# EAGLE schematic SensorNodeBoard_4_2_1AZ1b (EAGLE 7.6.0)

## Sheet 1 of 6
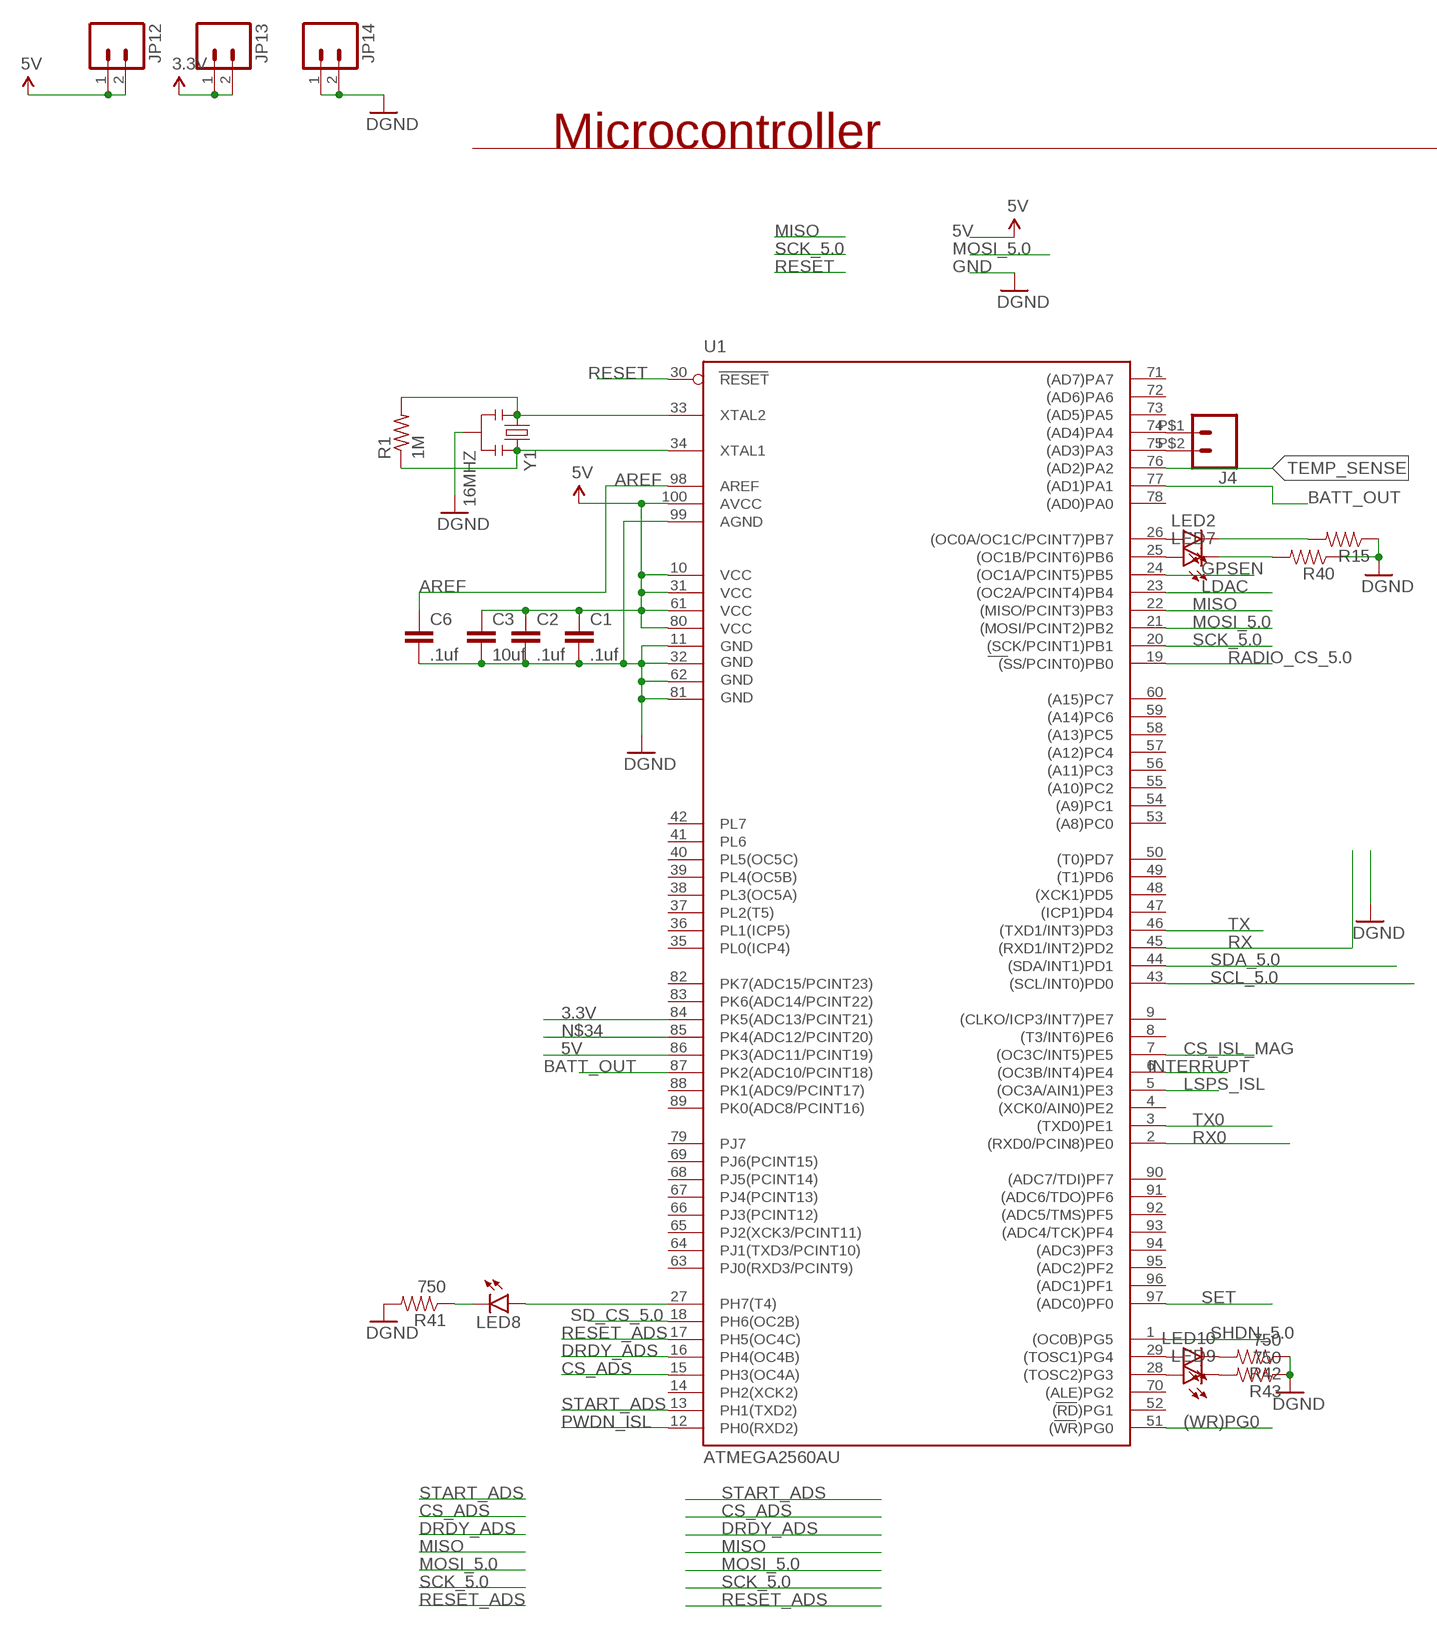
[diagram p0: schematic, sheet 1, part 1 of 2]
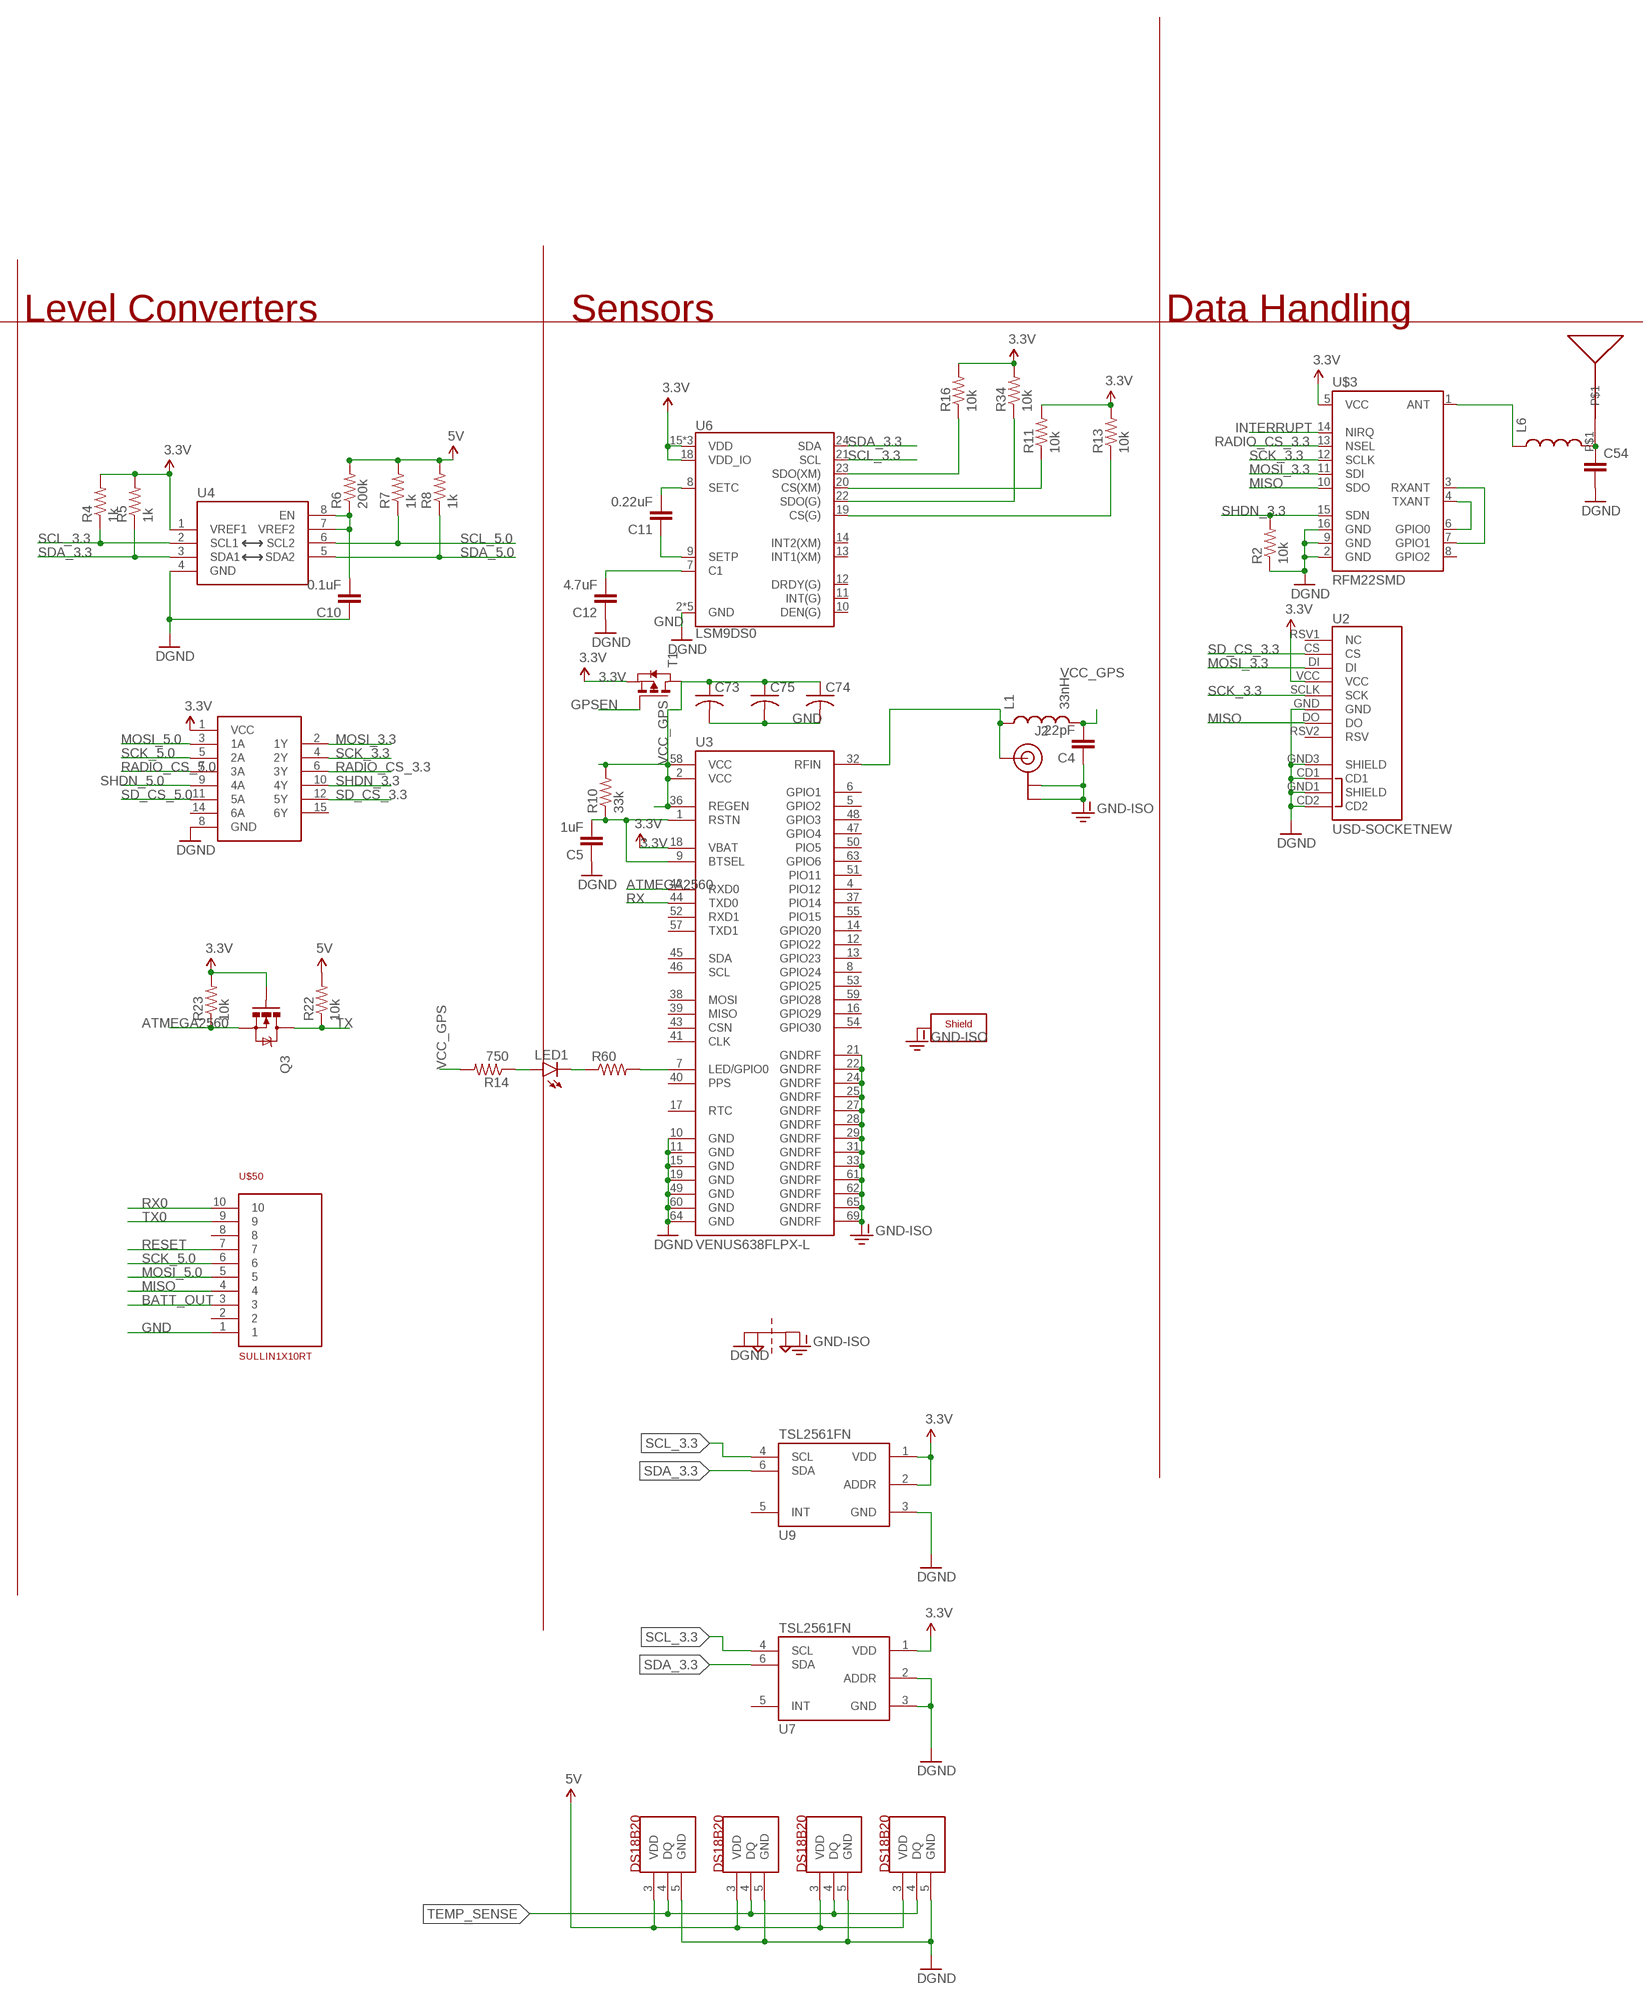
[diagram p1: schematic, sheet 1, part 2 of 2]

### Parts
C1  .1uf  CAP0603-CAP  [0603-CAP]
C2  .1uf  CAP0603-CAP  [0603-CAP]
C3  10uf  CAP0603-CAP  [0603-CAP]
C4  22pF  CAP0603-CAP  [0603-CAP]
C5  1uF  CAP0603-CAP  [0603-CAP]
C6  .1uf  CAP0603-CAP  [0603-CAP]
C10  0.1uF  CAP0603-CAP  [0603-CAP]
C11  0.22uF  CAP0603-CAP  [0603-CAP]
C12  4.7uF  CAP0603-CAP  [0603-CAP]
C54  CAP0603-CAP  [0603-CAP]
C73  C-USC0603K  [C0603K]
C74  C-USC0603K  [C0603K]
C75  C-USC0603K  [C0603K]
J2  U.FL  [U.FL]
J4  CONN_02HIROSE  [1X02_1.25]
JP12  M02LOCK  [1X02_LOCK]
JP13  M02LOCK  [1X02_LOCK]
JP14  M02LOCK  [1X02_LOCK]
L1  33nH  INDUCTOR0805  [0805]
L6  INDUCTOR0805  [0805]
LED1  LED0603  [LED-0603]
LED2  LED0603  [LED-0603]
LED7  LED0603  [LED-0603]
LED8  LED0603  [LED-0603]
LED9  LED0603  [LED-0603]
LED10  LED0603  [LED-0603]
PT1  2PT_GND_TIE  [2PT_GND_TIE]
Q3  MOSFET-NCHANNEL2N7002PW  [SOT323]
R1  1M  R-US_R1206  [R1206]
R2  10k  RESISTOR0603-RES  [0603-RES]
R4  1k  RESISTOR0603-RES  [0603-RES]
R5  1k  RESISTOR0603-RES  [0603-RES]
R6  200k  RESISTOR0603-RES  [0603-RES]
R7  1k  RESISTOR0603-RES  [0603-RES]
R8  1k  RESISTOR0603-RES  [0603-RES]
R10  33k  RESISTOR0603-RES  [0603-RES]
R11  10k  RESISTOR0603-RES  [0603-RES]
R13  10k  RESISTOR0603-RES  [0603-RES]
R14  750  RESISTOR0603-RES  [0603-RES]
R15  RESISTOR0603-RES  [0603-RES]
R16  10k  RESISTOR0603-RES  [0603-RES]
R22  10k  RESISTOR0603-RES  [0603-RES]
R23  10k  RESISTOR0603-RES  [0603-RES]
R34  10k  RESISTOR0603-RES  [0603-RES]
R40  RESISTOR0603-RES  [0603-RES]
R41  750  RESISTOR0603-RES  [0603-RES]
R42  750  RESISTOR0603-RES  [0603-RES]
R43  750  RESISTOR0603-RES  [0603-RES]
R60  R-US_R0603  [R0603]
T1  PMOSSOT23-6  [SOT23-6]
U1  ATMEGA2560AU  [TQFP100]
U2  USD-SOCKETNEW  [MICRO-SD-SOCKET-PP]
U3  VENUS638FLPX-L  [VENUS638FLPX]
U4  PCA9306  [PSOP-8]
U6  LSM9DS0  [LGA-24]
U7  TSL2561FN  [FN-6]
U9  TSL2561FN  [FN-6]
U$1  74HC4050  [TSSOP16]
U$3  RFM22SMD  [RFM22-XXX-S2]
U$23  SNB_ANT  [SLOT]
U$24  DS18B202  [SO08]
U$25  DS18B202  [SO08]
U$47  DS18B202  [SO08]
U$48  DS18B202  [SO08]
U$50  SULLIN1X10RT  [SULLRT1X10-2MM]
U$52  SHEILD3  [SHIELD_BMI-201-C-REV]
Y1  16MHZ  RESONATOR16MHZ  [RESONATOR-SMD]

### Nets
3.3V: JP13.1 JP13.2 Q3.1(G) R4.2 R5.2 R11.2 R13.2 R16.2 R23.2 R34.2 T1.4(S) U1.84(PK5(ADC13/PCINT21)) U2.VCC U3.18(VBAT) U4.1(VREF1) U6.15(VDD) U6.16(VDD) U6.17(VDD) U6.18(VDD_IO) U7.1(VDD) U9.1(VDD) U9.2(ADDR) U$1.1(VCC) U$3.5(VCC) ; also sheet 6
5V: C1.1 C2.1 C3.1 JP12.1 JP12.2 R6.2 R7.2 R8.2 R22.2 U1.10(VCC) U1.31(VCC1) U1.61(VCC2) U1.80(VCC3) U1.86(PK3(ADC11/PCINT19)) U1.100(AVCC) U$24.3(VDD) U$25.3(VDD) U$47.3(VDD) U$48.3(VDD) ; also sheet 5
(WR)PG0: U1.51((WR)PG0)
AREF: C6.1 U1.98(AREF)
ATMEGA2560: Q3.2(S) R23.1 U3.42(RXD0)
BATT_OUT: U1.77((AD1)PA1) U1.87(PK2(ADC10/PCINT18)) U$50.3 ; also sheet 3,4,5,6
CS_ADS: U1.15(PH3(OC4A)) ; also sheet 2
CS_ISL_MAG: U1.7((OC3C/INT5)PE5)
DRDY_ADS: U1.16(PH4(OC4B)) ; also sheet 2
GND: C1.2 C2.2 C3.2 C5.1 C6.2 C10.1 C12.1 C54.2 C73.2 C74.2 C75.2 JP14.1 JP14.2 PT1.P$1 R2.1 R15.1 R40.1 R41.2 R42.1 R43.1 U1.11(GND) U1.32(GND1) U1.62(GND2) U1.81(GND3) U1.99(AGND) U2.CD1 U2.CD2 U2.GND U2.GND1(SHIELD) U2.GND3(SHIELD) U3.10(GND) U3.11(GND) U3.15(GND) U3.19(GND) U3.49(GND) U3.60(GND) U3.64(GND) U4.4(GND) U6.2(GND) U6.3(GND) U6.4(GND) U6.5(GND) U6.6(GND) U7.2(ADDR) U7.3(GND) U9.3(GND) U$1.8(GND) U$3.2(GND) U$3.9(GND) U$3.16(GND) U$24.5(GND) U$25.5(GND) U$47.5(GND) U$48.5(GND) U$50.1 Y1.2 ; supply symbol labelled DGND ; also sheet 2,3,4,5,6
GND-ISO: C4.1 J2.P$1(GND) J2.P$2(GND) PT1.P$2 U3.21(GNDRF) U3.22(GNDRF) U3.24(GNDRF) U3.25(GNDRF) U3.27(GNDRF) U3.28(GNDRF) U3.29(GNDRF) U3.31(GNDRF) U3.33(GNDRF) U3.61(GNDRF) U3.62(GNDRF) U3.65(GNDRF) U3.69(GNDRF) U$52.P$1 U$52.P$2 U$52.P$3 U$52.P$4 U$52.P$5 U$52.P$6 U$52.P$7 U$52.P$8 U$52.P$9
GPSEN: T1.3(G) U1.24((OC1A/PCINT5)PB5)
INTERRUPT: U1.6((OC3B/INT4)PE4) U$3.14(NIRQ)
LDAC: U1.23((OC2A/PCINT4)PB4)
LSPS_ISL: U1.5((OC3A/AIN1)PE3)
MISO: U1.22((MISO/PCINT3)PB3) U2.DO U$3.10(SDO) U$50.4 ; also sheet 2
MOSI_3.3: U2.DI U$1.2(1Y) U$3.11(SDI)
MOSI_5.0: U1.21((MOSI/PCINT2)PB2) U$1.3(1A) U$50.5 ; also sheet 2
N$1: C11.1 U6.9(SETP)
N$2: J2.P$3(SIGNAL) L1.1 U3.32(RFIN)
N$3: R1.1 U1.34(XTAL1) Y1.3
N$4: R1.2 U1.33(XTAL2) Y1.1
N$7: C10.2 R6.1 U4.7(VREF2) U4.8(EN)
N$8: U$3.4(TXANT) U$3.6(GPIO0)
N$9: U$3.3(RXANT) U$3.7(GPIO1)
N$10: C11.2 U6.8(SETC)
N$11: C12.2 U6.7(C1)
N$13: LED2.A U1.26((OC0A/OC1C/PCINT7)PB7)
N$14: R11.1 U6.20(CS(XM))
N$15: R13.1 U6.19(CS(G))
N$16: J4.P$1 U1.74((AD4)PA4)
N$17: J4.P$2 U1.75((AD3)PA3)
N$18: C5.2 R10.1 U3.1(RSTN) U3.9(BTSEL)
N$19: LED1.A R14.1
N$20: LED1.C R60.1
N$21: LED2.C R15.2
N$25: R60.2 U3.7(LED/GPIO0)
N$34: U1.85(PK4(ADC12/PCINT20)) ; also sheet 4
N$36: R16.1 U6.23(SDO(XM))
N$37: R34.1 U6.22(SDO(G))
N$64: LED7.A U1.25((OC1B/PCINT6)PB6)
N$65: LED7.C R40.2
N$66: LED8.A U1.27(PH7(T4))
N$67: LED8.C R41.1
N$68: LED9.A U1.28((TOSC2)PG3)
N$69: LED10.A U1.29((TOSC1)PG4)
N$70: LED10.C R42.2
N$71: LED9.C R43.2
N$99: C54.1 L6.2 U$23.P$1
N$102: L6.1 U$3.1(ANT)
PWDN_ISL: U1.12(PH0(RXD2))
RADIO_CS_3.3: U$1.6(3Y) U$3.13(NSEL)
RADIO_CS_5.0: U1.19((SS/PCINT0)PB0) U$1.7(3A)
RESET: U1.30(RESET) U$50.7
RESET_ADS: U1.17(PH5(OC4C)) ; also sheet 2
RX: U1.45((RXD1/INT2)PD2) U3.44(TXD0)
RX0: U1.2((RXD0/PCIN8)PE0) U$50.10
SCK_3.3: U2.SCLK(SCK) U$1.4(2Y) U$3.12(SCLK)
SCK_5.0: U1.20((SCK/PCINT1)PB1) U$1.5(2A) U$50.6 ; also sheet 2
SCL_3.3: R4.1 U4.2(SCL1) U6.21(SCL) U7.4(SCL) U9.4(SCL)
SCL_5.0: R7.1 U1.43((SCL/INT0)PD0) U4.6(SCL2)
SD_CS_3.3: U2.CS U$1.12(5Y)
SD_CS_5.0: U1.18(PH6(OC2B)) U$1.11(5A)
SDA_3.3: R5.1 U4.3(SDA1) U6.24(SDA) U7.6(SDA) U9.6(SDA)
SDA_5.0: R8.1 U1.44((SDA/INT1)PD1) U4.5(SDA2)
SET: U1.97((ADC0)PF0) ; also sheet 2
SHDN_3.3: R2.2 U$1.10(4Y) U$3.15(SDN)
SHDN_5.0: U1.1((OC0B)PG5) U$1.9(4A)
START_ADS: U1.13(PH1(TXD2)) ; also sheet 2
TEMP_SENSE: U1.76((AD2)PA2) U$24.4(DQ) U$25.4(DQ) U$47.4(DQ) U$48.4(DQ)
TX: Q3.3(D) R22.1 U1.46((TXD1/INT3)PD3)
TX0: U1.3((TXD0)PE1) U$50.9
VCC_GPS: C4.2 C73.1 C74.1 C75.1 L1.2 R10.2 R14.2 T1.1(D) T1.2(D) T1.5(D) T1.6(D) U3.2(VCC) U3.36(REGEN) U3.58(VCC)
Unconnected: U1.4((XCK0/AIN0)PE2) U1.8((T3/INT6)PE6) U1.9((CLKO/ICP3/INT7)PE7) U1.14(PH2(XCK2)) U1.35(PL0(ICP4)) U1.36(PL1(ICP5)) U1.37(PL2(T5)) U1.38(PL3(OC5A)) U1.39(PL4(OC5B)) U1.40(PL5(OC5C)) U1.41(PL6) U1.42(PL7) U1.47((ICP1)PD4) U1.48((XCK1)PD5) U1.49((T1)PD6) U1.50((T0)PD7) U1.52((RD)PG1) U1.53((A8)PC0) U1.54((A9)PC1) U1.55((A10)PC2) U1.56((A11)PC3) U1.57((A12)PC4) U1.58((A13)PC5) U1.59((A14)PC6) U1.60((A15)PC7) U1.63(PJ0(RXD3/PCINT9)) U1.64(PJ1(TXD3/PCINT10)) U1.65(PJ2(XCK3/PCINT11)) U1.66(PJ3(PCINT12)) U1.67(PJ4(PCINT13)) U1.68(PJ5(PCINT14)) U1.69(PJ6(PCINT15)) U1.70((ALE)PG2) U1.71((AD7)PA7) U1.72((AD6)PA6) U1.73((AD5)PA5) U1.78((AD0)PA0) U1.79(PJ7) U1.82(PK7(ADC15/PCINT23)) U1.83(PK6(ADC14/PCINT22)) U1.88(PK1(ADC9/PCINT17)) U1.89(PK0(ADC8/PCINT16)) U1.90((ADC7/TDI)PF7) U1.91((ADC6/TDO)PF6) U1.92((ADC5/TMS)PF5) U1.93((ADC4/TCK)PF4) U1.94((ADC3)PF3) U1.95((ADC2)PF2) U1.96((ADC1)PF1) U2.RSV1(NC) U2.RSV2(RSV) U3.4(PIO12) U3.5(GPIO2) U3.6(GPIO1) U3.8(GPIO24) U3.12(GPIO22) U3.13(GPIO23) U3.14(GPIO20) U3.16(GPIO29) U3.17(RTC) U3.37(PIO14) U3.38(MOSI) U3.39(MISO) U3.40(PPS) U3.41(CLK) U3.43(CSN) U3.45(SDA) U3.46(SCL) U3.47(GPIO4) U3.48(GPIO3) U3.50(PIO5) U3.51(PIO11) U3.52(RXD1) U3.53(GPIO25) U3.54(GPIO30) U3.55(PIO15) U3.57(TXD1) U3.59(GPIO28) U3.63(GPIO6) U6.10(DEN(G)) U6.11(INT(G)) U6.12(DRDY(G)) U6.13(INT1(XM)) U6.14(INT2(XM)) U7.5(INT) U9.5(INT) U$1.14(6A) U$1.15(6Y) U$3.8(GPIO2) U$50.2 U$50.8

### Notes on the sheet
- Microcontroller | Level Converters | Sensors | Data Handling

## Sheet 2 of 6
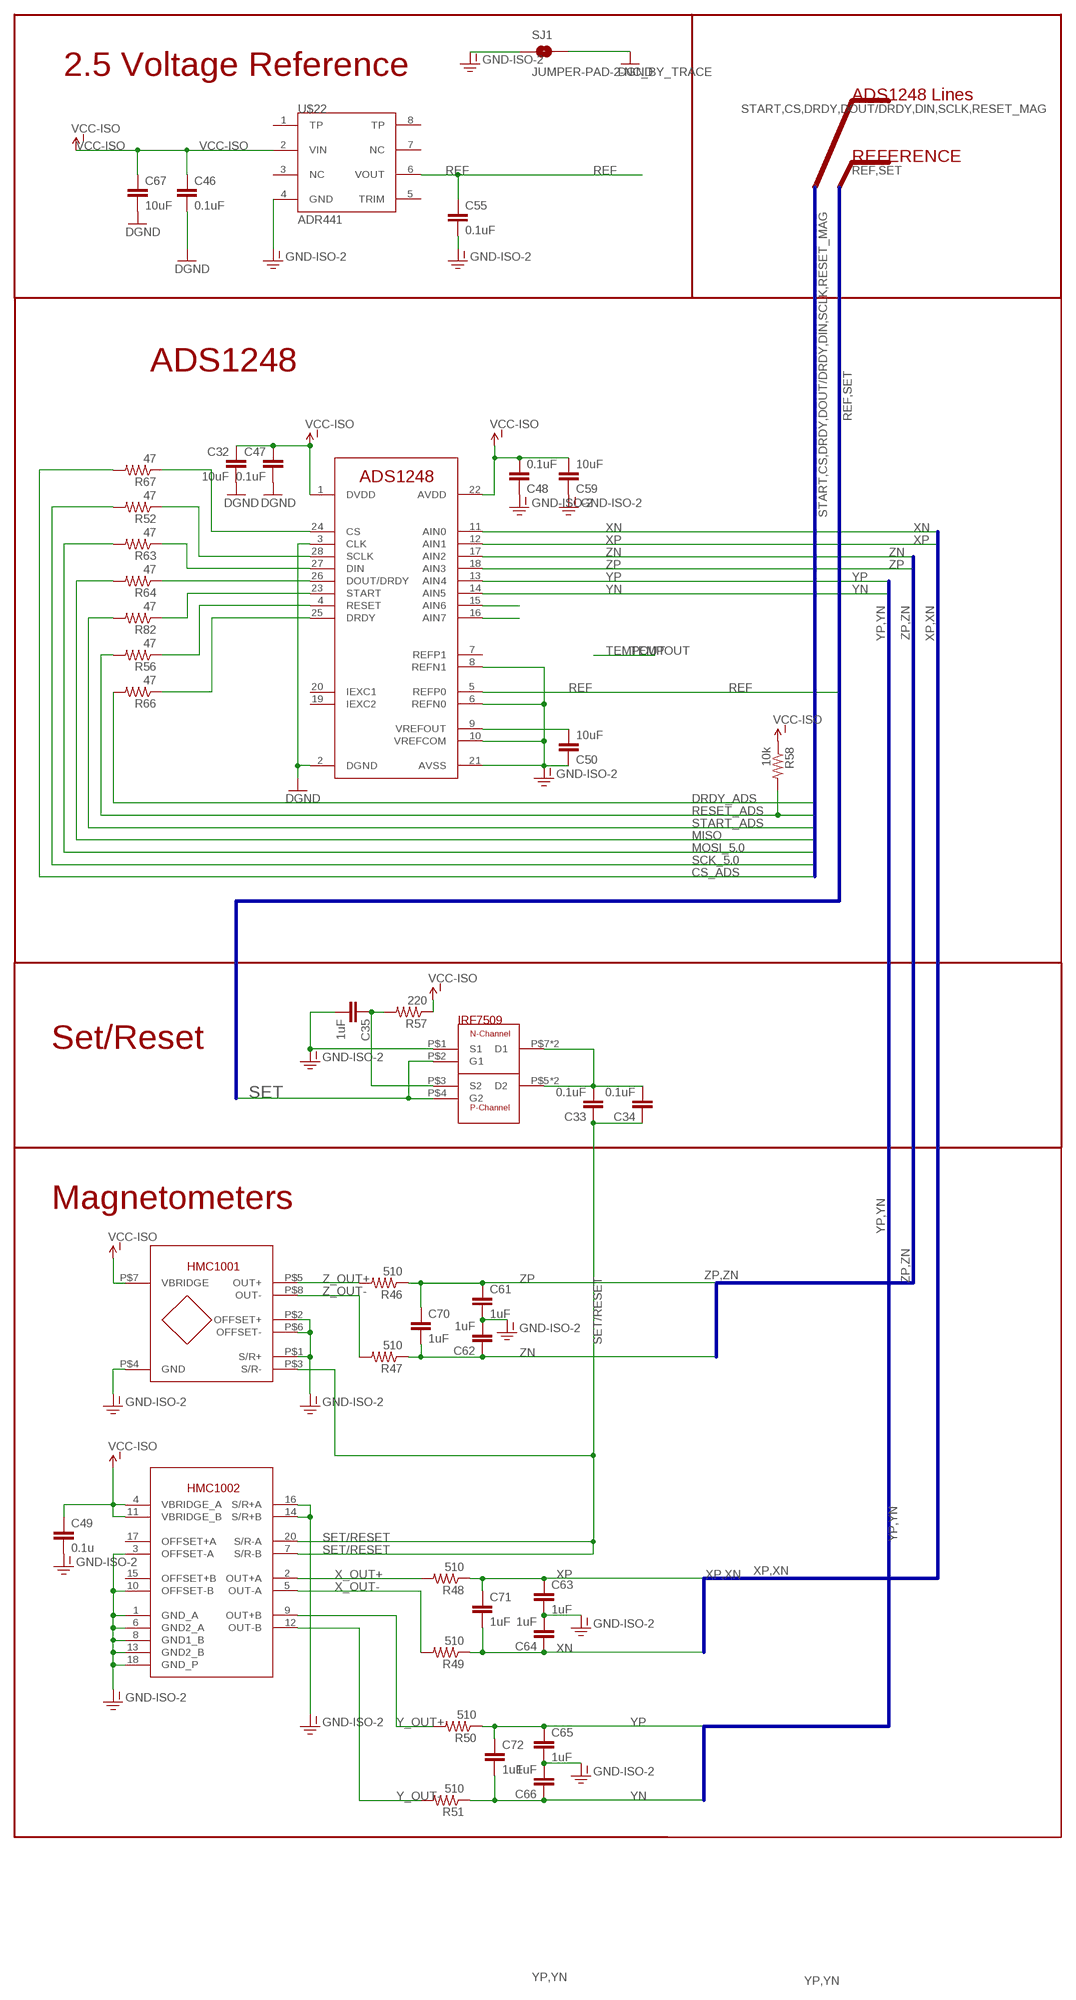
[diagram p2: schematic, sheet 2]

### Parts
C32  10uF  CAP0603-CAP  [0603-CAP]
C33  0.1uF  CAP0603-CAP  [0603-CAP]
C34  0.1uF  CAP0603-CAP  [0603-CAP]
C35  1uF  CAP0603-CAP  [0603-CAP]
C46  0.1uF  CAP0603-CAP  [0603-CAP]
C47  0.1uF  CAP0603-CAP  [0603-CAP]
C48  0.1uF  CAP0603-CAP  [0603-CAP]
C49  0.1u  CAP0603-CAP  [0603-CAP]
C50  10uF  CAP0603-CAP  [0603-CAP]
C55  0.1uF  CAP0603-CAP  [0603-CAP]
C59  10uF  CAP0603-CAP  [0603-CAP]
C61  1uF  CAP0603-CAP  [0603-CAP]
C62  1uF  CAP0603-CAP  [0603-CAP]
C63  1uF  CAP0603-CAP  [0603-CAP]
C64  1uF  CAP0603-CAP  [0603-CAP]
C65  1uF  CAP0603-CAP  [0603-CAP]
C66  1uF  CAP0603-CAP  [0603-CAP]
C67  10uF  CAP0603-CAP  [0603-CAP]
C70  1uF  CAP0603-CAP  [0603-CAP]
C71  1uF  CAP0603-CAP  [0603-CAP]
C72  1uF  CAP0603-CAP  [0603-CAP]
R46  510  RESISTOR0603-RES  [0603-RES]
R47  510  RESISTOR0603-RES  [0603-RES]
R48  510  RESISTOR0603-RES  [0603-RES]
R49  510  RESISTOR0603-RES  [0603-RES]
R50  510  RESISTOR0603-RES  [0603-RES]
R51  510  RESISTOR0603-RES  [0603-RES]
R52  47  RESISTOR0603-RES  [0603-RES]
R56  47  RESISTOR0603-RES  [0603-RES]
R57  220  RESISTOR0603-RES  [0603-RES]
R58  10k  RESISTOR0603-RES  [0603-RES]
R63  47  RESISTOR0603-RES  [0603-RES]
R64  47  RESISTOR0603-RES  [0603-RES]
R66  47  RESISTOR0603-RES  [0603-RES]
R67  47  RESISTOR0603-RES  [0603-RES]
R82  47  RESISTOR0603-RES  [0603-RES]
SJ1  JUMPER-PAD-2-NC_BY_TRACE  [PAD-JUMPER-2-NC_BY_TRACE_YES_SILK]
U$7  ADS1248  [TSSOP28]
U$11  HMC1002  [SOIC20R]
U$12  HMC1001  [HMC1001]
U$17  IRF7509  [MICRO8]
U$22  ADR441  [SOIC8]

### Nets
ADS4: R56.1 U$7.4(RESET)
ADS9: C50.2 U$7.9(VREFOUT)
ADS15: U$7.15(AIN6)
ADS16: U$7.16(AIN7)
ADS23: R82.1 U$7.23(START)
ADS24: R67.1 U$7.24(CS)
ADS25: R66.1 U$7.25(DRDY)
ADS26: R64.1 U$7.26(DOUT/DRDY)
ADS27: R63.1 U$7.27(DIN)
ADS28: R52.1 U$7.28(SCLK)
CS_ADS: R67.2 ; also sheet 1
DRDY_ADS: R66.2 ; also sheet 1
GND: C32.2 C46.2 C47.2 C67.2 SJ1.2 U$7.2(DGND) U$7.3(CLK) ; supply symbol labelled DGND ; also sheet 1,3,4,5,6
GND-ISO-2: C35.2 C48.1 C49.2 C50.1 C55.2 C59.1 C61.2 C62.2 C63.2 C64.2 C65.2 C66.2 SJ1.1 U$7.6(REFN0) U$7.8(REFN1) U$7.10(VREFCOM) U$7.21(AVSS) U$11.1(GND_A) U$11.3(OFFSET-A) U$11.6(GND2_A) U$11.8(GND1_B) U$11.10(OFFSET-B) U$11.13(GND2_B) U$11.14(S/R+B) U$11.16(S/R+A) U$11.18(GND_P) U$12.P$1(S/R+) U$12.P$2(OFFSET+) U$12.P$4(GND) U$12.P$6(OFFSET-) U$17.P$1(S1) U$22.4(GND)
MISO: R64.2 ; also sheet 1
MOSI_5.0: R63.2 ; also sheet 1
N$78: C33.2 C34.2 U$17.P$5(D2) U$17.P$6(D2) U$17.P$7(D1) U$17.P$8(D1)
N$79: C35.1 R57.2 U$17.P$3(S2)
REF: C55.1 U$7.5(REFP0) U$22.6(VOUT)
RESET_ADS: R56.2 R58.2 ; also sheet 1
SCK_5.0: R52.2 ; also sheet 1
SET: U$17.P$2(G1) U$17.P$4(G2) ; also sheet 1
SET/RESET: C33.1 C34.1 U$11.7(S/R-B) U$11.20(S/R-A) U$12.P$3(S/R-)
START_ADS: R82.2 ; also sheet 1
VCC-ISO: C32.1 C46.1 C47.1 C48.2 C49.1 C59.2 C67.1 R57.1 R58.1 U$7.1(DVDD) U$7.22(AVDD) U$11.4(VBRIDGE_A) U$11.11(VBRIDGE_B) U$12.P$7(VBRIDGE) U$22.2(VIN) ; also sheet 4
X_OUT+: R48.2 U$11.2(OUT+A)
X_OUT-: R49.2 U$11.5(OUT-A)
XN: C64.1 C71.2 R49.1 U$7.11(AIN0)
XP: C63.1 C71.1 R48.1 U$7.12(AIN1)
Y_OUT+: R50.2 U$11.9(OUT+B)
Y_OUT-: R51.2 U$11.12(OUT-B)
YN: C66.1 C72.2 R51.1 U$7.14(AIN5)
YP: C65.1 C72.1 R50.1 U$7.13(AIN4)
Z_OUT+: R46.2 U$12.P$5(OUT+)
Z_OUT-: R47.2 U$12.P$8(OUT-)
ZN: C62.1 C70.2 R47.1 U$7.17(AIN2)
ZP: C61.1 C70.1 R46.1 U$7.18(AIN3)
Unconnected: U$7.7(REFP1) U$7.19(IEXC2) U$7.20(IEXC1) U$11.15(OFFSET+B) U$11.17(OFFSET+A) U$22.1(TP) U$22.3(NC) U$22.5(TRIM) U$22.7(NC) U$22.8(TP)

### Buses
XP,XN
YP,YN
ZP,ZN
START,CS,DRDY,DOUT/DRDY,DIN,SCLK,RESET_MAG
REF,SET

### Notes on the sheet
- 2.5 Voltage Reference
- ADS1248 Lines
- REFERENCE
- ADS1248
- Set/Reset
- Magnetometers

## Sheet 3 of 6
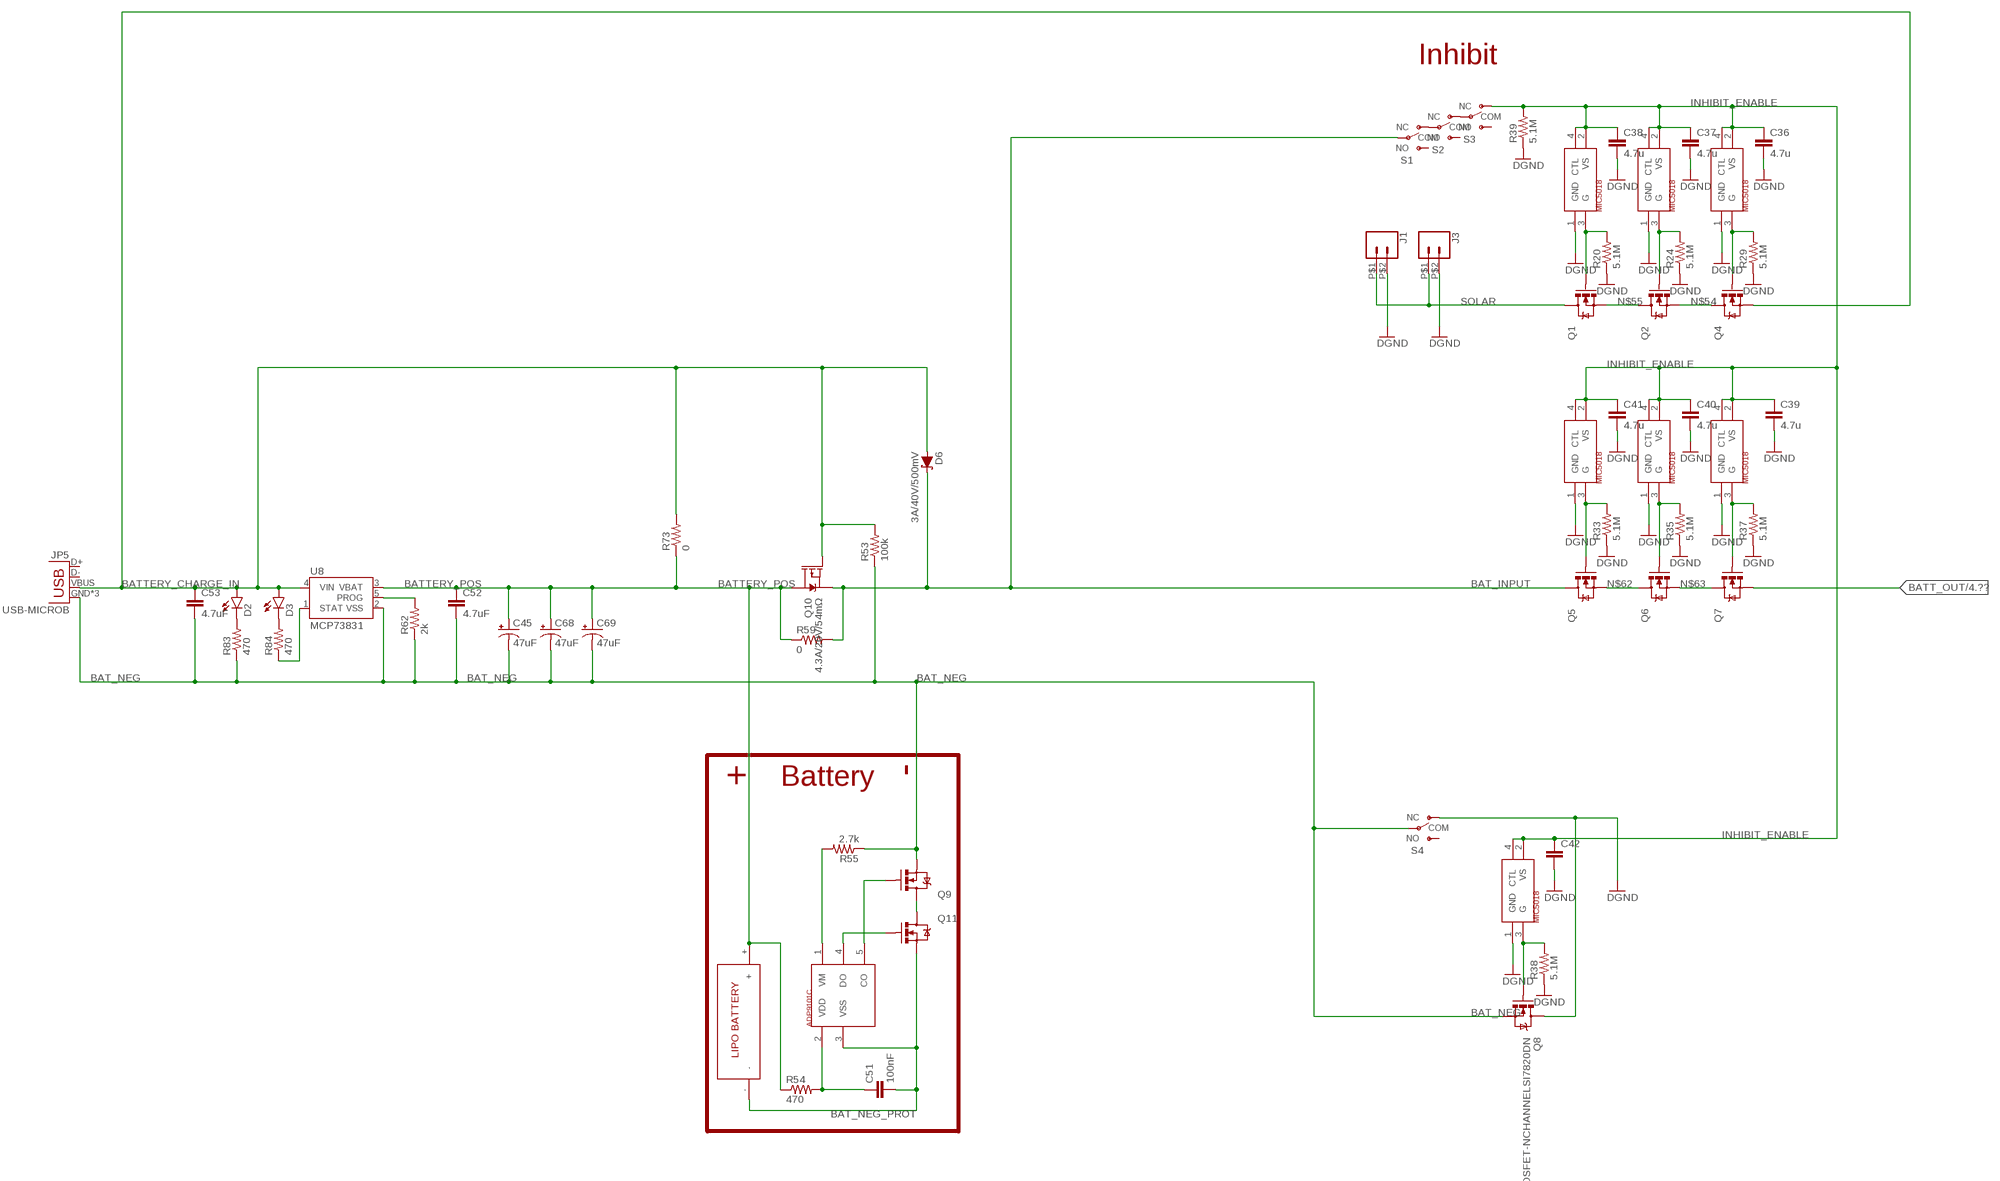
[diagram p3: schematic, sheet 3]

### Parts
C36  4.7u  CAP0603-CAP  [0603-CAP]
C37  4.7u  CAP0603-CAP  [0603-CAP]
C38  4.7u  CAP0603-CAP  [0603-CAP]
C39  4.7u  CAP0603-CAP  [0603-CAP]
C40  4.7u  CAP0603-CAP  [0603-CAP]
C41  4.7u  CAP0603-CAP  [0603-CAP]
C42  CAP0603-CAP  [0603-CAP]
C45  47uF  CAP_POL1206  [EIA3216]
C51  100nF  CAP0603-CAP  [0603-CAP]
C52  4.7uF  CAP0603-CAP  [0603-CAP]
C53  4.7uF  CAP0603-CAP  [0603-CAP]
C68  47uF  CAP_POL1206  [EIA3216]
C69  47uF  CAP_POL1206  [EIA3216]
D2  LED0603  [LED-0603]
D3  LED0603  [LED-0603]
D6  3A/40V/500mV  DIODE-SCHOTTKY-B340A  [SMA-DIODE]
J1  CONN_02HIROSE  [1X02_1.25]
J3  CONN_02HIROSE  [1X02_1.25]
JP5  USB-MICROB  [USB-MICROB]
Q1  MOSFET-NCHANNELSI7820DN  [POWERPAK1212-8]
Q2  MOSFET-NCHANNELSI7820DN  [POWERPAK1212-8]
Q4  MOSFET-NCHANNELSI7820DN  [POWERPAK1212-8]
Q5  MOSFET-NCHANNELSI7820DN  [POWERPAK1212-8]
Q6  MOSFET-NCHANNELSI7820DN  [POWERPAK1212-8]
Q7  MOSFET-NCHANNELSI7820DN  [POWERPAK1212-8]
Q8  MOSFET-NCHANNELSI7820DN  [POWERPAK1212-8]
Q9  MOSFET-NCHANNELSSM3K324R  [SOT23-3@1]
Q10  4.3A/20V/54mΩ  MOSFET_PCH-IRLML2244  [SOT23-3]
Q11  MOSFET-NCHANNELSSM3K324R  [SOT23-3@1]
R20  5.1M  RESISTOR0603-RES  [0603-RES]
R24  5.1M  RESISTOR0603-RES  [0603-RES]
R29  5.1M  RESISTOR0603-RES  [0603-RES]
R33  5.1M  RESISTOR0603-RES  [0603-RES]
R35  5.1M  RESISTOR0603-RES  [0603-RES]
R37  5.1M  RESISTOR0603-RES  [0603-RES]
R38  5.1M  RESISTOR0603-RES  [0603-RES]
R39  5.1M  RESISTOR0603-RES  [0603-RES]
R53  100k  RESISTOR0603-RES  [0603-RES]
R54  470  RESISTOR0603-RES  [0603-RES]
R55  2.7k  RESISTOR0603-RES  [0603-RES]
R59  0  RESISTOR2010  [R2010]
R62  2k  R-US_R0603  [R0603]
R73  0  RESISTOR2010  [R2010]
R83  470  RESISTOR0603-RES  [0603-RES]
R84  470  RESISTOR0603-RES  [0603-RES]
S1  SWITCH-SPDT  [CHERRY_SWITCH]
S2  SWITCH-SPDT  [CHERRY_SWITCH]
S3  SWITCH-SPDT  [CHERRY_SWITCH]
S4  SWITCH-SPDT  [CHERRY_SWITCH]
U8  MCP73831  [SOT23-5]
U$8  MIC5018  [SOT143]
U$13  MIC5018  [SOT143]
U$14  MIC5018  [SOT143]
U$15  MIC5018  [SOT143]
U$16  MIC5018  [SOT143]
U$18  BATTERY  [BATTERY]
U$19  MIC5018  [SOT143]
U$20  MIC5018  [SOT143]
U$27  AP9101C  [SOT25]

### Nets
BAT_INPUT: D6.C Q5.D1(D) Q5.D2(D) Q5.D3(D) Q5.D4(D) Q5.DPAD(D) Q10.2(S) R59.2 S1.COM
BAT_NEG: C45.C(-) C52.2 C53.2 C68.C(-) C69.C(-) JP5.GND JP5.MT1(GND) JP5.MT2(GND) Q8.S1(S) Q8.S2(S) Q8.S3(S) Q9.2(S) R53.1 R55.1 R62.1 R83.1 S4.COM U8.2(VSS)
BAT_NEG_PROT: C51.2 Q11.2(S) U$18.- U$27.3(VSS)
BATT_OUT: Q7.S1(S) Q7.S2(S) Q7.S3(S) ; also sheet 1,4,5,6
BATTERY_CHARGE_IN: C53.1 D2.A D3.A D6.A JP5.VBUS Q4.S1(S) Q4.S2(S) Q4.S3(S) Q10.1(G) R53.2 R73.2 U8.4(VIN)
BATTERY_POS: C45.A(+) C52.1 C68.A(+) C69.A(+) Q10.3(D) R54.1 R59.1 R73.1 U8.3(VBAT) U$18.+
GND: C36.2 C37.2 C38.2 C39.2 C40.2 C41.2 C42.2 J1.P$2 J3.P$2 Q8.D1(D) Q8.D2(D) Q8.D3(D) Q8.D4(D) Q8.DPAD(D) R20.1 R24.1 R29.1 R33.1 R35.1 R37.1 R38.1 R39.1 S4.NC U$8.1(GND) U$13.1(GND) U$14.1(GND) U$15.1(GND) U$16.1(GND) U$19.1(GND) U$20.1(GND) ; supply symbol labelled DGND ; also sheet 1,2,4,5,6
INHIBIT_ENABLE: C36.1 C37.1 C38.1 C39.1 C40.1 C41.1 C42.1 R39.2 S3.NC U$8.2(VS) U$8.4(CTL) U$13.2(VS) U$13.4(CTL) U$14.2(VS) U$14.4(CTL) U$15.2(VS) U$15.4(CTL) U$16.2(VS) U$16.4(CTL) U$19.2(VS) U$19.4(CTL) U$20.2(VS) U$20.4(CTL)
N$49: S1.NC S2.COM
N$50: S2.NC S3.COM
N$51: Q1.G R20.2 U$8.3(G)
N$52: Q2.G R24.2 U$13.3(G)
N$53: Q4.G R29.2 U$14.3(G)
N$54: Q2.S1(S) Q2.S2(S) Q2.S3(S) Q4.D1(D) Q4.D2(D) Q4.D3(D) Q4.D4(D) Q4.DPAD(D)
N$55: Q1.S1(S) Q1.S2(S) Q1.S3(S) Q2.D1(D) Q2.D2(D) Q2.D3(D) Q2.D4(D) Q2.DPAD(D)
N$56: D2.C R83.2
N$57: Q11.1(G) U$27.4(DO)
N$59: Q5.G R33.2 U$15.3(G)
N$60: Q6.G R35.2 U$16.3(G)
N$61: Q7.G R37.2 U$19.3(G)
N$62: Q5.S1(S) Q5.S2(S) Q5.S3(S) Q6.D1(D) Q6.D2(D) Q6.D3(D) Q6.D4(D) Q6.DPAD(D)
N$63: Q6.S1(S) Q6.S2(S) Q6.S3(S) Q7.D1(D) Q7.D2(D) Q7.D3(D) Q7.D4(D) Q7.DPAD(D)
N$75: Q8.G R38.2 U$20.3(G)
N$96: Q9.1(G) U$27.5(CO)
N$97: Q9.3(D) Q11.3(D)
N$98: R62.2 U8.5(PROG)
N$100: R55.2 U$27.1(VM)
N$101: C51.1 R54.2 U$27.2(VDD)
N$104: D3.C R84.2
N$105: R84.1 U8.1(STAT)
SOLAR: J1.P$1 J3.P$1 Q1.D1(D) Q1.D2(D) Q1.D3(D) Q1.D4(D) Q1.DPAD(D)
Unconnected: JP5.D+ JP5.D- S1.NO S2.NO S3.NO S4.NO

### Notes on the sheet
- Inhibit
- + | -
- Battery

## Sheet 4 of 6
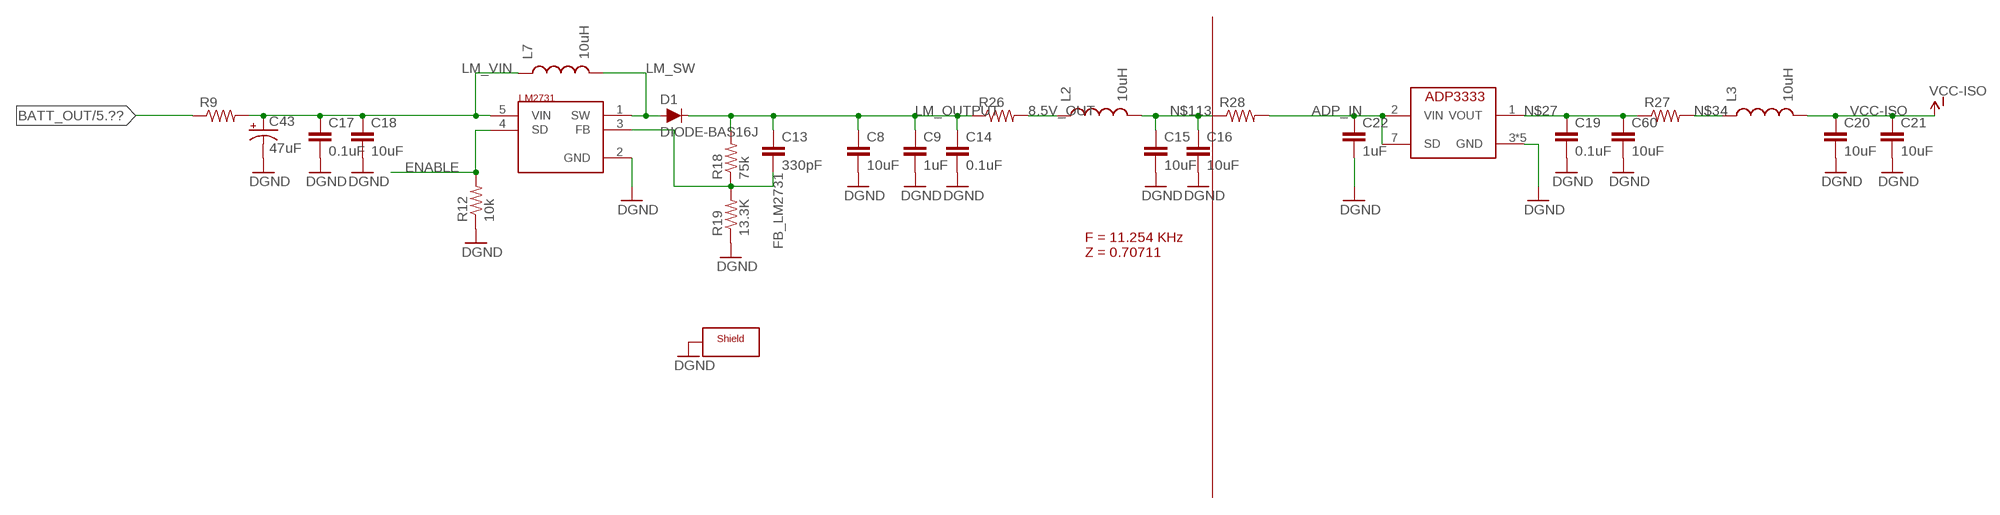
[diagram p4: schematic, sheet 4]

### Parts
C8  10uF  CAP0603-CAP  [0603-CAP]
C9  1uF  CAP0603-CAP  [0603-CAP]
C13  330pF  CAP0603-CAP  [0603-CAP]
C14  0.1uF  CAP0603-CAP  [0603-CAP]
C15  10uF  CAP0603-CAP  [0603-CAP]
C16  10uF  CAP0603-CAP  [0603-CAP]
C17  0.1uF  CAP0603-CAP  [0603-CAP]
C18  10uF  CAP0603-CAP  [0603-CAP]
C19  0.1uF  CAP0603-CAP  [0603-CAP]
C20  10uF  CAP0603-CAP  [0603-CAP]
C21  10uF  CAP0603-CAP  [0603-CAP]
C22  1uF  CAP0603-CAP  [0603-CAP]
C43  47uF  CAP_POL1206  [EIA3216]
C60  10uF  CAP0603-CAP  [0603-CAP]
D1  DIODE-BAS16J  [SOD-323]
L2  10uH  INDUCTOR1210  [1210]
L3  10uH  INDUCTOR1210  [1210]
L7  10uH  INDUCTOR1210  [1210]
R9  RESISTOR1206  [1206]
R12  10k  RESISTOR0603-RES  [0603-RES]
R18  75k  RESISTOR0603-RES  [0603-RES]
R19  13.3K  RESISTOR0603-RES  [0603-RES]
R26  RESISTOR1206  [1206]
R27  RESISTOR1206  [1206]
R28  RESISTOR1206  [1206]
U$4  LM2731  [SOT23-5]
U$6  ADP3333  [MSOP-8]
U$37  SHEILD2  [SHIELD_BMI-S-209-C]

### Nets
8.5V_OUT: L2.1 R26.2
ADP_IN: C22.1 R28.2 U$6.2(VIN) U$6.7(SD)
BATT_OUT: R9.1 ; also sheet 1,3,5,6
ENABLE: R12.2 U$4.4(SD) ; also sheet 5,6
FB_LM2731: C13.2 R18.1 R19.2 U$4.3(FB)
GND: C8.2 C9.2 C14.2 C15.2 C16.2 C17.2 C18.2 C19.2 C20.2 C21.2 C22.2 C43.C(-) C60.2 R12.1 R19.1 U$4.2(GND) U$6.3(GND) U$6.4(GND) U$6.5(GND) U$6.6(GND) U$6.8(GND) U$37.P$1 U$37.P$2 U$37.P$3 U$37.P$4 U$37.P$5 U$37.P$6 U$37.P$7 U$37.P$8 U$37.P$9 U$37.P$10 U$37.P$11 U$37.P$12 U$37.P$13 U$37.P$14 U$37.P$15 U$37.P$16 ; supply symbol labelled DGND ; also sheet 1,2,3,5,6
LM_OUTPUT: C8.1 C9.1 C13.1 C14.1 D1.C R18.2 R26.1
LM_SW: D1.A L7.2 U$4.1(SW)
LM_VIN: C17.1 C18.1 C43.A(+) L7.1 R9.2 U$4.5(VIN)
N$27: C19.1 C60.1 R27.1 U$6.1(VOUT)
N$34: L3.1 R27.2 ; also sheet 1
N$113: C15.1 C16.1 L2.2 R28.1
VCC-ISO: C20.1 C21.1 L3.2 ; also sheet 2

### Notes on the sheet
- F = 11.254 KHz
  Z = 0.70711

## Sheet 5 of 6
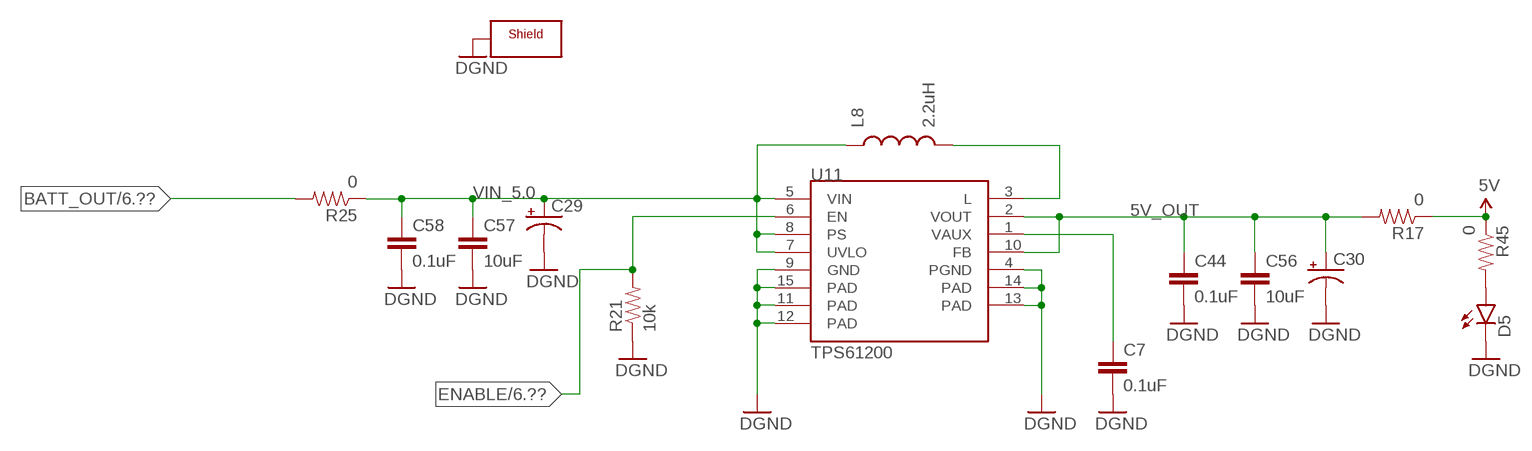
[diagram p5: schematic, sheet 5]

### Parts
C7  0.1uF  CAP0603-CAP  [0603-CAP]
C29  CAP_POL1206  [EIA3216]
C30  CAP_POL1206  [EIA3216]
C44  0.1uF  CAP0603-CAP  [0603-CAP]
C56  10uF  CAP0603-CAP  [0603-CAP]
C57  10uF  CAP0603-CAP  [0603-CAP]
C58  0.1uF  CAP0603-CAP  [0603-CAP]
D5  LED0603  [LED-0603]
L8  2.2uH  INDUCTOR1210  [1210]
R17  0  RESISTOR1206  [1206]
R21  10k  RESISTOR0603-RES  [0603-RES]
R25  0  RESISTOR1206  [1206]
R45  0  RESISTOR0603-RES  [0603-RES]
U11  TPS61200  [QFN-10_PAD]
U$39  SHEILD  [SHIELD_BMI-S-201-C]

### Nets
5V: R17.1 R45.1 ; also sheet 1
5V_OUT: C30.A(+) C44.1 C56.1 R17.2 U11.2(VOUT) U11.10(FB)
BATT_OUT: R25.2 ; also sheet 1,3,4,6
ENABLE: R21.2 U11.6(EN) ; also sheet 4,6
GND: C7.2 C29.C(-) C30.C(-) C44.2 C56.2 C57.2 C58.2 D5.C R21.1 U11.4(PGND) U11.9(GND) U11.11(PAD) U11.12(PAD) U11.13(PAD) U11.14(PAD) U11.15(PAD) U$39.P$1 U$39.P$2 U$39.P$3 U$39.P$4 U$39.P$5 U$39.P$6 U$39.P$7 U$39.P$8 U$39.P$9 U$39.P$10 U$39.P$11 U$39.P$12 ; supply symbol labelled DGND ; also sheet 1,2,3,4,6
N$5: L8.2 U11.3(L)
N$6: C7.1 U11.1(VAUX)
N$44: D5.A R45.2
VIN_5.0: C29.A(+) C57.1 C58.1 L8.1 R25.1 U11.5(VIN) U11.7(UVLO) U11.8(PS)

## Sheet 6 of 6
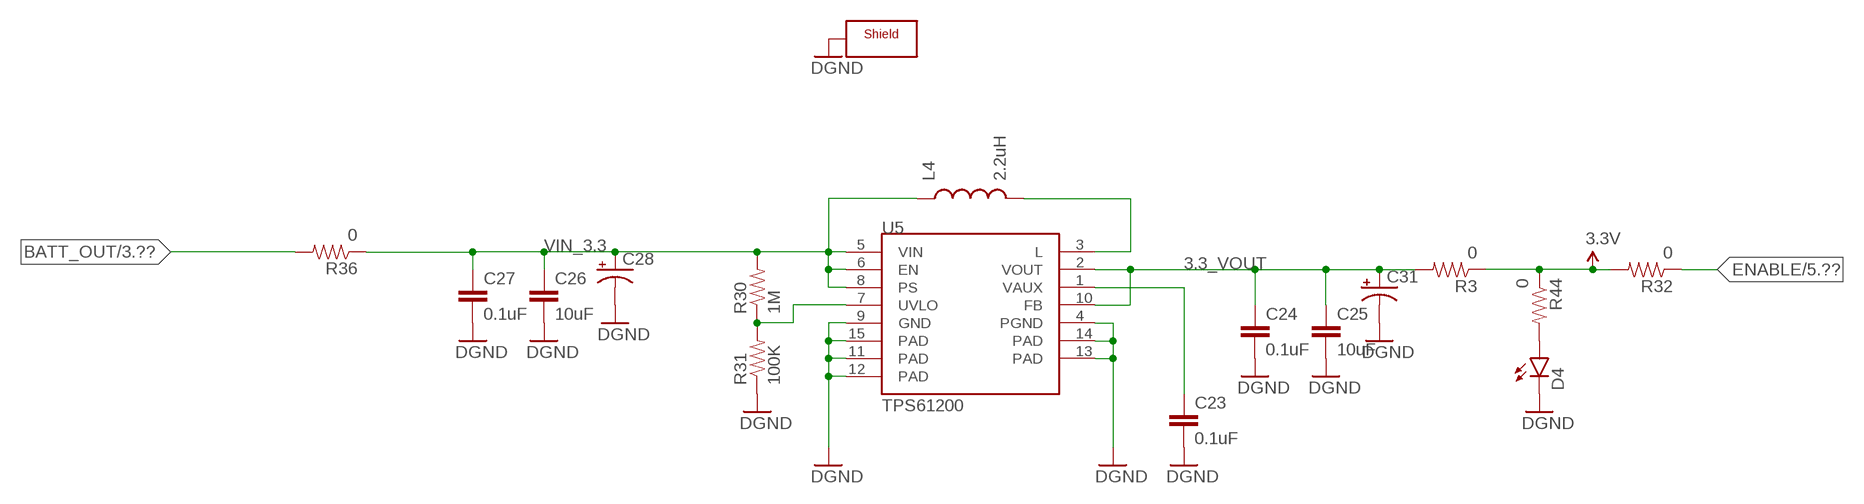
[diagram p6: schematic, sheet 6]

### Parts
C23  0.1uF  CAP0603-CAP  [0603-CAP]
C24  0.1uF  CAP0603-CAP  [0603-CAP]
C25  10uF  CAP0603-CAP  [0603-CAP]
C26  10uF  CAP0603-CAP  [0603-CAP]
C27  0.1uF  CAP0603-CAP  [0603-CAP]
C28  CAP_POL1206  [EIA3216]
C31  CAP_POL1206  [EIA3216]
D4  LED0603  [LED-0603]
L4  2.2uH  INDUCTOR1210  [1210]
R3  0  RESISTOR1206  [1206]
R30  1M  RESISTOR0603-RES  [0603-RES]
R31  100K  RESISTOR0603-RES  [0603-RES]
R32  0  RESISTOR0603-RES  [0603-RES]
R36  0  RESISTOR1206  [1206]
R44  0  RESISTOR0603-RES  [0603-RES]
U5  TPS61200  [QFN-10_PAD]
U$41  SHEILD  [SHIELD_BMI-S-201-C]

### Nets
3.3_UVLO: R30.1 R31.2 U5.7(UVLO)
3.3_VOUT: C24.1 C25.1 C31.A(+) R3.2 U5.2(VOUT) U5.10(FB)
3.3V: R3.1 R32.2 R44.1 ; also sheet 1
BATT_OUT: R36.2 ; also sheet 1,3,4,5
ENABLE: R32.1 ; also sheet 4,5
GND: C23.2 C24.2 C25.2 C26.2 C27.2 C28.C(-) C31.C(-) D4.C R31.1 U5.4(PGND) U5.9(GND) U5.11(PAD) U5.12(PAD) U5.13(PAD) U5.14(PAD) U5.15(PAD) U$41.P$1 U$41.P$2 U$41.P$3 U$41.P$4 U$41.P$5 U$41.P$6 U$41.P$7 U$41.P$8 U$41.P$9 U$41.P$10 U$41.P$11 U$41.P$12 ; supply symbol labelled DGND ; also sheet 1,2,3,4,5
N$22: L4.2 U5.3(L)
N$23: C23.1 U5.1(VAUX)
N$43: D4.A R44.2
VIN_3.3: C26.1 C27.1 C28.A(+) L4.1 R30.2 R36.1 U5.5(VIN) U5.6(EN) U5.8(PS)

## Library data of the parts
C1-C27 C33-C35 C44 C51-C54 C56-C58 C60-C66 C70-C72 = SparkFun-Passives:CAP: Capacitor Standard 0603 ceramic capacitor, and 0.1" leaded capacitor.
C28-C31 C43 C45 C68 C69 = SparkFun-Passives:CAP_POL: Capacitor Polarized These are standard SMD and PTH capacitors. Normally 10uF, 47uF, and 100uF in electrolytic and tantalum varieties. Always verify the external diameter of the through hole cap, it varies with capacity, voltage, and manufacturer. The EIA devices should be standard.
C32 C36-C42 C46-C50 C55 C59 C67 = SparkFun-Capacitors:CAP: Capacitor Standard 0603 ceramic capacitor, and 0.1" leaded capacitor.
C73-C75 = resistor:C-US: CAPACITOR, American symbol
D1 = SparkFun-DiscreteSemi:DIODE: Diode These are standard reverse protection diodes and small signal diodes. SparkFun Products: SparkFun SparkPunk Sound Kit <https://www.sparkfun.com/products/11177> SparkFun ESP8266 Thing <https://www.sparkfun.com/products/13231>; PROD_ID: DIO-09646; VALUE: 250mA/100V
D2-D5 LED1 LED2 LED7-LED10 = SparkFun-LED:LED: LEDs Standard schematic elements and footprints for 5mm, 3mm, 1206, and 0603 sized LEDs. 5mm - Spark Fun Electronics SKU : COM-00529 (and others)
D6 = SparkFun-DiscreteSemi:DIODE-SCHOTTKY: Schottky diode A Schottky diode is a semiconductor diode which has a low forward voltage drop and a very fast switching action.; PROD_ID: DIO-09886
J1 J3 J4 = PC104_Cubesat:CONN_02: Multi connection point. Often used as Generic Header-pin footprint for 0.1 inch spaced/style header connections On any of the 0.1 inch spaced packages, you can populate with these: Break Away Headers - Straight <https://www.sparkfun.com/products/116> (PRT-00116) Break Away Male Headers - Right Angle <https://www.sparkfun.com/products/553> (PRT-00553) Female Headers <https://www.sparkfun.com/products/115> (PRT-00115) Break Away Headers - Machine Pin <https://www.sparkfun.com/products/117> (PRT-00117) Break Away Female Headers - Swiss Machine Pin <https://www.sparkfun.com/products/743> (PRT-00743) For SCREWTERMINALS and SPRING TERMINALS visit here: Screw Terimnals on SparkFun.com <https://www.sparkfun.com/search/results?term=Screw+Terminals> (5mm/3.5mm/2.54mm spacing) This device is also useful as a general connection point to wire up your design to another part of your project. Our various solder wires solder well into these plated through hole pads. Hook-Up Wire - Assortment (Stranded, 22 AWG) <https://www.sparkfun.com/products/11375> (PRT-11375) Hook-Up Wire - Assortment (Solid Core, 22 AWG) <https://www.sparkfun.com/products/11367> (PRT-11367) View the entire wire category on our website here <https://www.sparkfun.com/categories/141> Special notes: Molex polarized connector foot print use with: PRT-08233 with associated crimp pins and housings. 2.54_SCREWTERM for use with PRT-10571. 3.5mm Screw Terminal footprints for PRT-08084 5mm Screw Terminal footprints for use with PRT-08432
J2 = SparkFun-Connectors:U.FL: SMD antenna connector- WRL-09144; PROD_ID: CONN-09193
JP5 = SparkFun-Connectors:USB: USB Connectors USB-B-PTH is fully proven SKU : PRT-00139/CONN-08278 USB-miniB is fully proven SKU : PRT-00587 USB-A-PCB is untested. USB-A-H is throughly reviewed, but untested. Spark Fun Electronics SKU : PRT-00437 USB-B-SMT is throughly reviewed, but untested. Needs silkscreen touching up. USB-A-S has not been used/tested USB-MB-H has not been used/tested USB-MICROB has been used. CONN-09505; PROD_ID: CONN-09505
JP12-JP14 = SparkFun-Connectors:M02: Standard 2-pin 0.1" header. Use with - straight break away headers ( PRT-00116) - right angle break away headers (PRT-00553) - swiss pins (PRT-00743) - machine pins (PRT-00117) - female headers (PRT-00115) Molex polarized connector foot print use with: PRT-08233 with associated crimp pins and housings. 2.54_SCREWTERM for use with PRT-10571. 3.5mm Screw Terminal footprints for PRT-08084 5mm Screw Terminal footprints for use with PRT-08432
L1-L4 L6-L8 = SparkFun-Passives:INDUCTOR: Inductors Basic Inductor/Choke - 0603 and 1206. Footprints are not proven and vary greatly between part numbers. INDUCTOR POWER 3.3UH 4.0A SMD 0.197" L x 0.197" W x 0.177" H (5.00mm x 5.00mm x 4.50mm)
PT1 = SparkFun-Passives:2PT_GND_TIE: Package for connecting two ground nets in one place.
Q1 Q2 Q4-Q8 = SparkFun-DiscreteSemi:MOSFET-NCHANNEL: Common NMOSFET Parts MFG P/N Store ID Prod ID FDD8780 TRANS-09984 SI7820DN TRANS-11055 FDS6630A IC-08089 2N7002PW TRANS-11151 FQP30N06L COM-10213 TRANS-10060 BSS123LT1G TRANS-08345 BSS138 TRANS-00830 BS170 2N7000; PROD_ID: TRANS-11055
Q3 = SparkFun-DiscreteSemi:MOSFET-NCHANNEL: Common NMOSFET Parts MFG P/N Store ID Prod ID FDD8780 TRANS-09984 SI7820DN TRANS-11055 FDS6630A IC-08089 2N7002PW TRANS-11151 FQP30N06L COM-10213 TRANS-10060 BSS123LT1G TRANS-08345 BSS138 TRANS-00830 BS170 2N7000; PROD_ID: TRANS-11151
Q9 Q11 = SparkFun-DiscreteSemi:MOSFET-NCHANNEL: Common NMOSFET Parts MFG P/N Store ID Prod ID FDD8780 TRANS-09984 SI7820DN TRANS-11055 FDS6630A IC-08089 2N7002PW TRANS-11151 FQP30N06L COM-10213 TRANS-10060 BSS123LT1G TRANS-08345 BSS138 TRANS-00830 BS170 2N7000
Q10 = SparkFun-DiscreteSemi:MOSFET_PCH: P-channel MOSFETs Voltage controlled devices that allow control of high current outputs. SparkFun Products: SparkFun ESP32 Thing <https://www.sparkfun.com/products/13907> SparkFun ESP8266 Thing <https://www.sparkfun.com/products/13231>; PROD_ID: TRANS-11153
R1 R60 R62 = resistor:R-US_: RESISTOR, American symbol
R2-R59 R63 R64 R66 R67 R73 R82-R84 = SparkFun-Passives:RESISTOR: Resistor Basic schematic elements and footprints for 0603, 1206, and PTH resistors.
S1-S4 = PC104_Cubesat:SWITCH-SPDT: SPDT Switch Simple slide switch, Spark Fun Electronics SKU : COM-00102 DPDT SMT slide switch, AYZ0202, SWCH-08179
SJ1 = SparkFun-Passives:JUMPER-PAD-2-NC_BY_TRACE
T1 = zetex:PMOSSOT23-6: P-CHANNEL ENHANCEMENT MODE MOSFET Source: Data sheet <http://www.diodes.com/zetex/_pdfs/3.0/pdf/ZXMP10A17E6.pdf> ZXMP10A17E6; OC_FARNELL: unknown; OC_NEWARK: unknown
U1 = SparkFun-DigitalIC:ATMEGA2560: Atmel 100-pin 8-bit uC 64/128/256 Kbytes FLASH 4 Kbytes EEPROM 8 Kbytes SRAM 86 General Purpose I/O pins 12-channels16-bit PWM 4 x Serial USARTs 16-channels 10-bit A/D; PROD_ID: IC-10040
U2 = SparkFun-Connectors:USD-SOCKET: microSD Socket Push-push type uSD socket. Schematic element and footprint production proven. Spark Fun Electronics SKU : PRT-00127. tDoc lines correctly indicate media card edge positions when inserting (unlocked, locked, depressed). NOTE: CD1 and CD2 are connected internally; PROD_ID: CONN-07820
U3 = SparkFun-RF:VENUS638FLPX-L: Venus638FLPX-L GPS Receiver Venus638FLPx is a high performance, low cost, single chip GPS receiver targeting mobile consumer and cellular handset applications. It offers very low power consumption, high sensitivity, and best in class signal acquisition and time-to-first-fix performance. Venus638FLPx contains all the necessary components of a complete GPS receiver, includes 1.2dB cascaded system NF RF front-end, GPS baseband signal processor, 0.5ppm TCXO, 32.768kHz RTC crystal, RTC LDO regulator, and passive components. It requires very low external component count and takes up only 100mm2 PCB footprint. Dedicated massive-correlator signal parameter search engine within the baseband enables rapid search of all the available satellites and acquisition of very weak signal. An advanced track engine allows weak signal tracking and positioning in harsh environments such as urban canyons and under deep foliage. The self-contained architecture keeps GPS processing off the host and allows integration into applications with very little resource. FEATURES 20Hz update rate -148dBm cold start sensitivity -165dBm tracking sensitivity 29 second cold start TTFF 3.5 second TTFF with AGPS 1 second hot start 2.5m accuracy Multipath detection and suppression Jamming detection and mitigation SBAS (WAAS / EGNOS) support 7-day extended ephemeris AGPS 67mW full power navigation Works directly with active or passive antenna Internal flash for optional 75K point data logging Supports external SPI flash memory data logging Complete receiver in 10mm x 10mm x 1.3mm size Contains LNA, SAW Filter, TCXO, RTC Xtal, LDO Pb-free RoHS compliant
U4 = SparkFun-DigitalIC:PCA9306: Bidirectional I2C level shifter. NOT compatible with all available part number pinout schemes- DOUBLE CHECK!!!; PROD_ID: IC-10023; VALUE: PCA9306
U5 U11 = SparkFun-PowerIC:TPS61200: DC to DC Booster IC-10035; PROD_ID: IC-10035
U6 = SparkFun-DigitalIC:LSM9DS0: LSM9DS0 3D Accelerometer, 3D Gyroscope, 3D Magnetomter Features: 3 acceleration channels, 3 angular rate channels, 3 magnetic field channels ±2/±4/±6/±8/±16 g linear acceleration full scale ±2/±4/±8/±12 gauss magnetic full scale ±245/±500/±2000 dps angular rate full scale 16-bit data output SPI / I2C serial interfaces Analog supply voltage 2.4 V to 3.6 V Power-down mode / low-power mode Programmable interrupt generators Embedded self-test Embedded temperature sensor Embedded FIFO Position and motion detection functions Click/double-click recognition
U7 U9 = SparkFun-DigitalIC:TSL2561: TSL2561 illumination sensor Approximates Human Eye Response Precisely Measures Illuminance Programmable Interrupt Function with User-Defined Upper and Lower Threshold 400 KHz I2C interface Programmable Analog Gain and Integration Time Supporting 1,000,000-to-1 Dynamic Range Automatically Rejects 50/60-Hz Lighting Ripple Low Active Power (0.75 mW Typical) with Power Down Mode RoHS Compliant The TSL2561 is a light-to-digital converter that transform light intensity to a digital signal output via I2C interface. The device combines one broadband photodiode (visible plus infrared) and one infrared-responding photodiode on a single CMOS integrated circuit capable of providing a near-photopic response over an effective 20-bit dynamic range (16-bit resolution). Two integrating ADCs convert the photodiode currents to a digital output that represents the irradiance measured on each channel. This digital output can be input to a microprocessor where illuminance (ambient light level) in lux is derived using an empirical formula to approximate the human eye response. The TSL2561 device supports a traditional level style interrupt that remains asserted until the firmware clears it.; PROD_ID: IC-11791
U8 = SparkFun-PowerIC:MCP73831: Miniature single cell, fully integrated Li-Ion, Li-polymer charge management controller http://ww1.microchip.com/downloads/en/DeviceDoc/20001984g.pdf IC-09995; PROD_ID: IC-09995
U$1 = 74hc4050:74HC4050
U$3 = SparkFun-RF:RFM22: The RFM22 is a low-power, low cost radio that is capable of operating in the 434MHz and 900MHz open bands. It's frequency is software defined and there are some very good libraries written for it.
U$4 = PC104_Cubesat:LM2731
U$6 = PC104_Cubesat:ADP3333
U$7 = PC104_Cubesat:ADS1248
U$8 U$13-U$16 U$19 U$20 = PC104_Cubesat:MIC5018
U$11 = PC104_Cubesat:HMC1002
U$12 = PC104_Cubesat:HMC1001
U$17 = PC104_Cubesat:IRF7509
U$18 = PC104_Cubesat:BATTERY
U$22 = PC104_Cubesat:ADR441
U$23 = PC104_Cubesat:SNB_ANT
U$24 U$25 U$47 U$48 = PC104_Cubesat:DS18B20
U$27 = Solar:AP9101C
U$37 U$39 U$41 U$52 = PC104_Cubesat:SHEILD
U$50 = PC104_Cubesat:SULLIN1X10RT
Y1 = SparkFun-FreqCtrl:RESONATOR: Resonator Small SMD resonator. Used, eg, on the Arduino Pro/ Pro Mini boards. 8MHz- XTAL-08895 16MHz- XTAL-08900; PROD_ID: XTAL-08900